# Altium schematic sheet POWER.SchDoc
size A; SheetNumber: 6; SheetTotal: 8
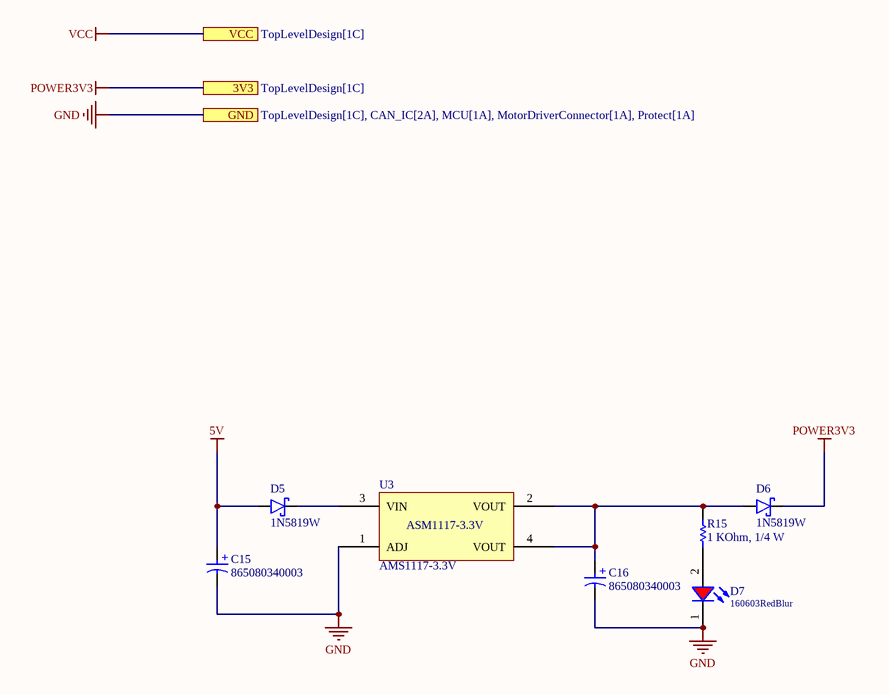
[diagram p0: POWER.SchDoc]

## Parts
C15  865080340003  [WCAP-ASLI_D4H5.5]
C16  865080340003  [WCAP-ASLI_D4H5.5]
D5  1N5819W  [1N5819W]
D6  1N5819W  [1N5819W]
D7  160603RedBlur  [WL-SMCW_0603_H=0.7mm]
R15  value 1 KOhm, 1/4 W  [resistor_0603]  (hidden comment: 0006031021)
U3  AMS1117-3.3V  [AMS1117-3.3V SOT223]

## Ports
3V3 (see TopLevelDesign[1C]), GND (see TopLevelDesign[1C], CAN_IC[2A], MCU[1A], MotorDriverConnector[1A], Protect[1A]), VCC (see TopLevelDesign[1C])

## Nets
5V: C15.1(P) D5.A
GND: C15.2(N) C16.2(N) D7.1(K) U3.1(ADJ) ; port GND
POWER3V3: D6.K ; port 3V3
VCC: port VCC
NetC16_1: C16.1(P) D6.A R15.2 U3.2(VOUT) U3.4(VOUT)
NetD5_K: D5.K U3.3(VIN)
NetD7_2: D7.2(A) R15.1

## Notes on the sheet
- (in symbol CMP-014-00040-1) +
- (in symbol CMP-098-000070-1) ASM1117-3.3V

## Library data of the parts
C15 C16 = CMP-014-00040-1: V-Chip, D4 x H5.5mm, 22uF, 16V; Manufacturer: Wurth Elektronik; Capacitance Tolerance: +/-20%; Leakage Current: 3.52uA; Endurance: 2000h; Ripple Current: 90mA; Dissipation Factor: 16%; Capacitance: 22µF; Height: 5.5mm; Supplier 2 Name: Digi-Key; Mount: Surface Mount; Supplier 1 URL: https://www.mouser.com/ProductDetail/Wurth-Elektronik/865080340003?qs=0KOYDY2FL2%252BowmC4S50IuQ%3D%3D; Operating Temperature Min: -55°C; Source: Al_Cap.SchLib; Component Type: Standard; Operating Temperature Max: 105°C; Supplier 2 URL: N/A; Supplier 2 SN: N/A; Supplier 1 Name: Mouser; Supplier 3 Name: thegioiic; Packaging: Tape and Reel; Supplier 3 SN: N/A; Diameter: 4mm; Supplier 3 URL: https://www.thegioiic.com/tu-nhom-smd-22uf-16v-4x5-4mm; Value: 22uF, 16V; Supplier 1 SN: 710-865080340003; Category: Aluminum Electrolytic Capacitors; Design Item ID: 865080340003; Rated Voltage (DC): 16V; Manufacturer Part Number: N/A; Pins: 2
D5 D6 = CMP-004-00113-1: Source: 1N5819W.SchLib; Design Item ID: 1N5819W; Pins: 2; Component Type: Standard
D7 = CMP-004-00093-1: WL-SMCW SMT Mono-color Chip LED Blur, size 0603, Red, 2V, 140deg; Value: Red, 2V; ComponentLink2URL: https://www.mouser.vn/ProductDetail/ROHM-Semiconductor/CSL1901VW1?qs=vvQtp7zwQdNmrXZcE27xEA%3D%3D; Supplier 2 URL: https://www.digikey.com/en/products/detail/rohm-semiconductor/SML-D12U8WT86/1641799; Pins: 2; Supplier 2 Name: Digi-Key; ComponentLink1Description: Datasheet link; ComponentLink3URL: https://www.digikey.com/en/products/detail/rohm-semiconductor/SML-D12U8WT86/1641799; Supplier 1 Name: Mouser; Supplier 1 SN: 755-CSL1901VW1; Size: 0603; ComponentLink1URL: N/A; Source: WL-SMCW_0603.SchLib; ComponentLink3Description: Supplier 2 URL; Type: Blur; Design Item ID: 160603RedBlur; Component Type: Standard; ComponentLink4URL: N/A; Supplier 3 Name: ICDayRoi; Supplier 3 SN: N/A; Color: Red; Supplier 1 URL: https://www.mouser.vn/ProductDetail/ROHM-Semiconductor/CSL1901VW1?qs=vvQtp7zwQdNmrXZcE27xEA%3D%3D; Supplier 2 SN: 511-1580-2-ND; ComponentLink2Description: Supplier 1 URL; Supplier 3 URL: N/A; ComponentLink4Description: Supplier 3 URL
R15 = CMP-009-00186-1: RES, size 0603, 1 KOhm, 1/4 W; Manufacture  SN: OEM; Rated Power: 1/4 W; Resistance Tolerance: +/-1%; Supplier 1 SN: 71-RCS06031K00FKEA; ComponentLink4Description: Supplier 3 URL; ComponentLink2Description: Supplier 1 URL; Supplier 3 SN: N/A; Supplier 2 Name: Digi-Key; ComponentLink3Description: Supplier 2 URL; Pins: 2; ComponentLink4URL: N/A; Source: Resistor_0603.SchLib; ComponentLink3URL: https://www.digikey.com/en/products/detail/yageo/SR0603FR-7T1KL/9373103; Supplier 2 SN: YAG5829TR-ND YAG5829CT-ND YAG5829DKR-ND; Supplier 2 URL: https://www.digikey.com/en/products/detail/yageo/SR0603FR-7T1KL/9373103; Supplier 1 Name: Mouser; Component Type: Standard; ComponentLink2URL: N/A; Size: 0603; Supplier 1 URL: https://www.mouser.vn/ProductDetail/Vishay-Dale/RCS06031K00FKEA?qs=sGAEpiMZZMvdGkrng054t9clqp6gtJJdzI9PGMrTQi4RTIuHToNahw%3D%3D; Supplier 3 URL: N/A; Design Item ID: 0006031021; Mounting Technology: SMT; ComponentLink1URL: https://www.yageo.com/upload/media/product/productsearch/datasheet/rchip/PYu-SR_20105_RoHS_L_10.pdf; ComponentLink1Description: Datasheet link; Supplier 3 Name: thegioiic; Manufacture  Name: OEM
U3 = CMP-098-000070-1: AMS1117-3.3V, OUT 3.3V 1A.; Manufacturer: AMS; Voltage Input Maximum: 15V; Pad Count: 4; Current Output Maximum: 1A; Value: 3.3V, 1A; Supplier 2 Name: Digi-Key; Supplier 3 URL: https://www.thegioiic.com/ams1117-3-3v-ic-on-ap-3-3v-1a-sot-223; Pin Count: 4; ComponentLink2URL: N/A; ComponentLink2Description: Supplier 1 URL; ComponentLink1Description: Datasheet link; Supplier 1 Name: Mouser; Supplier 2 SN: N/A; Manufacturer Part Number: N/A; ComponentLink1URL: http://www.advanced-monolithic.com/pdf/ds1117.pdf; ComponentLink4URL: N/A; Supplier 3 SN: N/A; Supplier 3 Name: thegioiic; Supplier 2 URL: N/A; ComponentLink3URL: N/A; Supplier 1 SN: N/A; Mounting Technology: SMD; ComponentLink4Description: Supplier 3 URL; Component Type: Standard; Voltage Output: 3.3V; ComponentLink3Description: Supplier 2 URL; Design Item ID: AMS1117-3.3V; Supplier 1 URL: N/A; Current Input Maximum: N/A; Source: AMS_family.SchLib